# EAGLE design 0.2 (EAGLE 7.6.0)
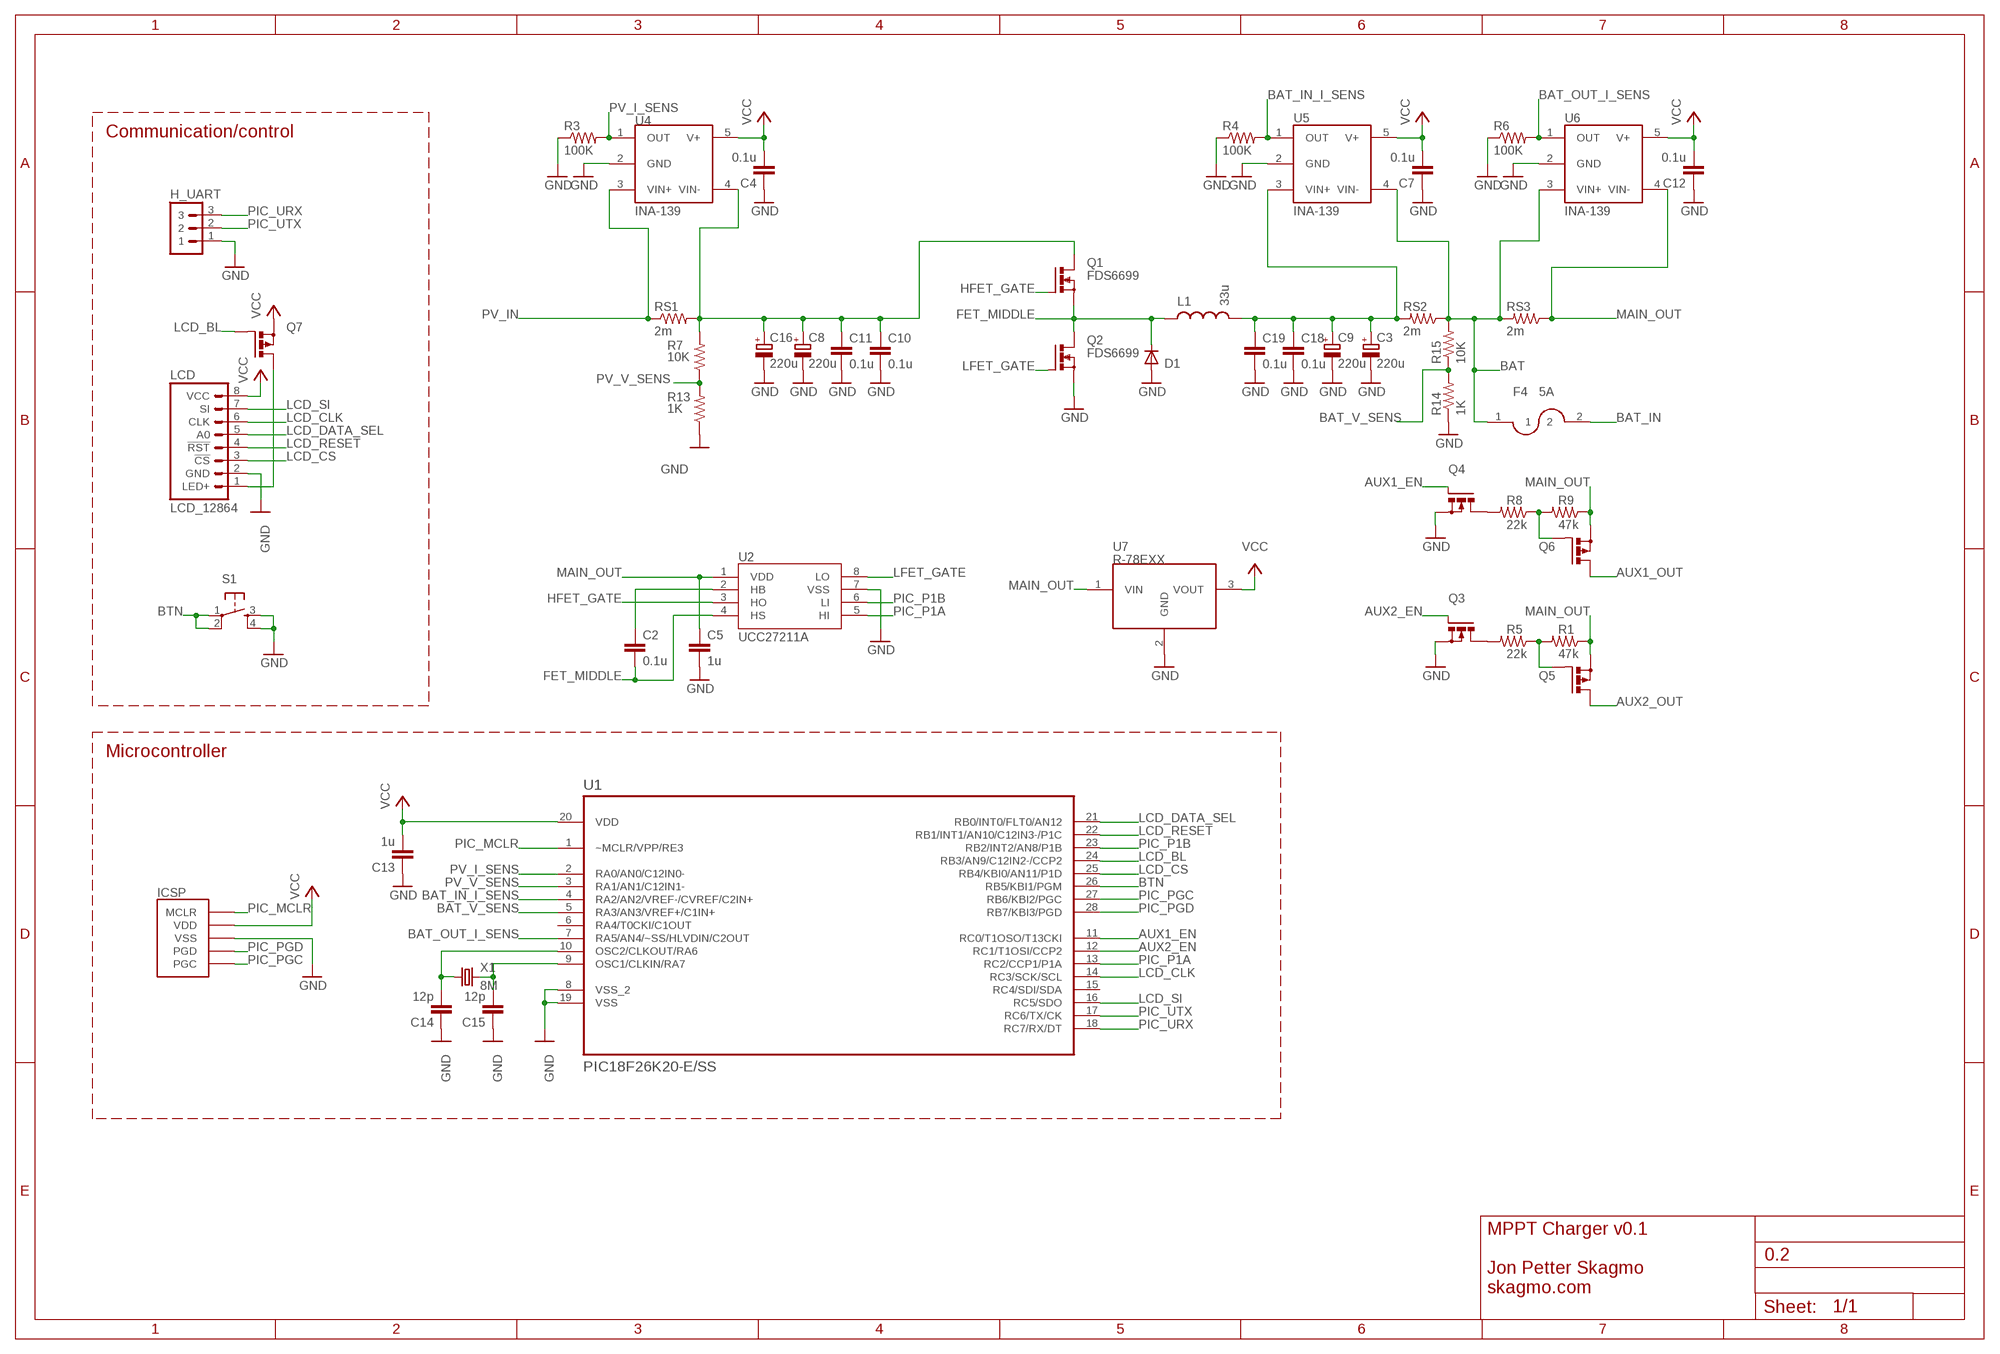
[diagram p0: schematic, sheet 1]

## Parts
C2  0.1u  CAP0603  [0603]
C3  220u  CPOL-EUE3.5-8  [E3,5-8]
C4  0.1u  CAP0603  [0603]
C5  1u  CAP0603  [0603]
C7  0.1u  CAP0603  [0603]
C8  220u  CPOL-EUE3.5-8  [E3,5-8]
C9  220u  CPOL-EUE3.5-8  [E3,5-8]
C10  0.1u  CAP0603  [0603]
C11  0.1u  CAP0603  [0603]
C12  0.1u  CAP0603  [0603]
C13  1u  CAP0603  [0603]
C14  12p  CAP0603  [0603]
C15  12p  CAP0603  [0603]
C16  220u  CPOL-EUE3.5-8  [E3,5-8]
C18  0.1u  CAP0603  [0603]
C19  0.1u  CAP0603  [0603]
D1  DIODESMB  [SMB-DIODE]
F4  5A  FUSE1206  [1206]
H_UART  H1X3_XH  [CON_B3B-XH-A]
ICSP  1X5_ICSP  [1X5_2MM]
L1  33u  INDUCTORIHLP-6767  [IHLP-6767]
LCD  LCD_12864  [LCD_12864]
Q1  FDS6699  PMOSFET_N  [SO08]
Q2  FDS6699  PMOSFET_N  [SO08]
Q3  MOSFET_N_SOT23-3  [SOT23-3]
Q4  MOSFET_N_SOT23-3  [SOT23-3]
Q5  PMOSFET_P  [SO08]
Q6  PMOSFET_P  [SO08]
Q7  MOSFET_P_SOT23  [SOT23-3]
R1  47k  RESISTOR0603  [0603]
R3  100K  RESISTOR0603  [0603]
R4  100K  RESISTOR0603  [0603]
R5  22k  RESISTOR0603  [0603]
R6  100K  RESISTOR0603  [0603]
R7  10K  RESISTOR0603  [0603]
R8  22k  RESISTOR0603  [0603]
R9  47k  RESISTOR0603  [0603]
R13  1K  RESISTOR0603  [0603]
R14  1K  RESISTOR0603  [0603]
R15  10K  RESISTOR0603  [0603]
RS1  2m  R-US_R3225  [R3225]
RS2  2m  R-US_R3225  [R3225]
RS3  2m  R-US_R3225  [R3225]
S1  TAC_SWITCH  [SWITCH_B3FS-1002P]
U1  PIC18F26K20-E/SS  [SOP65P780X200-28N]
U2  UCC27211A  [SO08]
U4  INA-139  INA-169  [SOT23-5]
U5  INA-139  INA-169  [SOT23-5]
U6  INA-139  INA-169  [SOT23-5]
U7  R-78EXX  [R-78EXX]
X1  8M  TXC-7A  [TXC-7A]

## Nets
AUX1_EN: Q4.1(G) U1.11(RC0/T1OSO/T13CKI)
AUX1_OUT: Q6.5(D) Q6.6(D) Q6.7(D) Q6.8(D)
AUX2_EN: Q3.1(G) U1.12(RC1/T1OSI/CCP2)
AUX2_OUT: Q5.5(D) Q5.6(D) Q5.7(D) Q5.8(D)
BAT: F4.1 R15.2 RS2.1 RS3.2 U5.4(VIN-) U6.3(VIN+)
BAT_IN: F4.2
BAT_IN_I_SENS: R4.2 U1.4(RA2/AN2/VREF-/CVREF/C2IN+) U5.1(OUT)
BAT_OUT_I_SENS: R6.2 U1.7(RA5/AN4/~SS/HLVDIN/C2OUT) U6.1(OUT)
BAT_V_SENS: R14.2 R15.1 U1.5(RA3/AN3/VREF+/C1IN+)
BTN: S1.1 S1.2 U1.26(RB5/KBI1/PGM)
FET_MIDDLE: C2.2 D1.C L1.P$1 Q1.1(S) Q1.2(S) Q1.3(S) Q2.5(D) Q2.6(D) Q2.7(D) Q2.8(D) U2.4(HS)
GND: C3.- C4.1 C5.2 C7.1 C8.- C9.- C10.2 C11.2 C12.1 C13.1 C14.1 C15.1 C16.- C18.2 C19.2 D1.A H_UART.1 ICSP.P$3(VSS) LCD.2(GND) Q2.1(S) Q2.2(S) Q2.3(S) Q3.2(S) Q4.2(S) R3.1 R4.1 R6.1 R13.1 R14.1 S1.3 S1.4 U1.8(VSS_2) U1.19(VSS) U2.7(VSS) U4.2(GND) U5.2(GND) U6.2(GND) U7.2(GND)
HFET_GATE: Q1.4(G) U2.3(HO)
LCD_BL: Q7.1(G) U1.24(RB3/AN9/C12IN2-/CCP2)
LCD_CLK: LCD.6(CLK) U1.14(RC3/SCK/SCL)
LCD_CS: LCD.3(!CS) U1.25(RB4/KBI0/AN11/P1D)
LCD_DATA_SEL: LCD.5(A0) U1.21(RB0/INT0/FLT0/AN12)
LCD_RESET: LCD.4(!RST) U1.22(RB1/INT1/AN10/C12IN3-/P1C)
LCD_SI: LCD.7(SI) U1.16(RC5/SDO)
LFET_GATE: Q2.4(G) U2.8(LO)
MAIN_OUT: C5.1 Q5.1(S) Q5.2(S) Q5.3(S) Q6.1(S) Q6.2(S) Q6.3(S) R1.1 R9.1 RS3.1 U2.1(VDD) U6.4(VIN-) U7.1(VIN)
N$2: C2.1 U2.2(HB)
N$3: Q3.3(D) R5.2
N$4: Q4.3(D) R8.2
N$5: C3.+ C9.+ C18.1 C19.1 L1.P$2 RS2.2 U5.3(VIN+)
N$7: Q5.4(G) R1.2 R5.1
N$14: C14.2 U1.10(OSC2/CLKOUT/RA6) X1.1
N$15: Q6.4(G) R8.1 R9.2
N$16: C15.2 U1.9(OSC1/CLKIN/RA7) X1.2
N$31: LCD.1(LED+) Q7.3(D)
PIC_MCLR: ICSP.P$1(MCLR) U1.1(~MCLR/VPP/RE3)
PIC_P1A: U1.13(RC2/CCP1/P1A) U2.5(HI)
PIC_P1B: U1.23(RB2/INT2/AN8/P1B) U2.6(LI)
PIC_PGC: ICSP.P$5(PGC) U1.27(RB6/KBI2/PGC)
PIC_PGD: ICSP.P$4(PGD) U1.28(RB7/KBI3/PGD)
PIC_URX: H_UART.3 U1.18(RC7/RX/DT)
PIC_UTX: H_UART.2 U1.17(RC6/TX/CK)
PV: C8.+ C10.1 C11.1 C16.+ Q1.5(D) Q1.6(D) Q1.7(D) Q1.8(D) R7.2 RS1.2 U4.4(VIN-)
PV_I_SENS: R3.2 U1.2(RA0/AN0/C12IN0-) U4.1(OUT)
PV_IN: RS1.1 U4.3(VIN+)
PV_V_SENS: R7.1 R13.2 U1.3(RA1/AN1/C12IN1-)
VCC: C4.2 C7.2 C12.2 C13.2 ICSP.P$2(VDD) LCD.8(VCC) Q7.2(S) U1.20(VDD) U4.5(V+) U5.5(V+) U6.5(V+) U7.3(VOUT)
Unconnected: U1.6(RA4/T0CKI/C1OUT) U1.15(RC4/SDI/SDA)

## Notes on the sheet
- Communication/control
- Microcontroller
- MPPT Charger v0.1
  
  Jon Petter Skagmo
  skagmo.com

## Library data of the parts
C2 C4 C5 C7 C10-C15 C18 C19 = 01-eos-components:CAP: Capacitor Standard 0603 ceramic capacitor, and 0.1" leaded capacitor.; PARTNO: *
C3 C8 C9 C16 = rcl:CPOL-EU: POLARIZED CAPACITOR, European symbol; PARTNO: 35ZLH220MEFC8X11.5
D1 = SparkFun:DIODE: Diode These are standard reverse protection diodes and small signal diodes. SMA package can handle up to about 1A. SOD-323 can handle about 200mA. What the SOD-323 package when ordering, there are some mfgs out there that are 5-pin packages.; PARTNO: SK54B-LTP
F4 = 01-eos-components:FUSE; PARTNO: C1T 5
H_UART = 01-eos-components:H1X3: Header 3 Standard 3-pin 0.1" header. Use with straight break away headers (SKU : PRT-00116), right angle break away headers (PRT-00553), swiss pins (PRT-00743), machine pins (PRT-00117), and female headers (PRT-00115). Molex polarized connector foot print use with SKU : PRT-08232 with associated crimp pins and housings.; PARTNO: B3B-XH-A (LF)(SN)(P)
ICSP = 01-eos-components:1X5_ICSP; PARTNO: *
L1 = 01-eos-components:INDUCTOR: Inductors Basic Inductor/Choke - 0603 and 1206. Footprints are not proven and vary greatly between part numbers.; PARTNO: IHLP6767GZER330M11
LCD = 01-eos-components:LCD_12864; PARTNO: *
Q1 Q2 = 01-eos-components:PMOSFET_N: Power MOSFET N-Channel; PARTNO: SI4128DY-T1-GE3
Q3 Q4 = 01-eos-components:MOSFET_N; PARTNO: BSH103,215
Q5 Q6 = 01-eos-components:PMOSFET_P: Power MOSFET P-Channel; PARTNO: FDS6681Z
Q7 = 01-eos-components:MOSFET_P; PARTNO: *
R1 R3-R9 R13-R15 = 01-eos-components:RESISTOR: Resistor Basic schematic elements and footprints for 0603, 1206, and PTH 1/10th watt (small) resistors.; PARTNO: *
RS1-RS3 = rcl:R-US_: RESISTOR, American symbol; PARTNO: PMR25HZPFV2L00
S1 = 00-mr-library:TAC_SWITCH: Momentary Switch Button commonly used for reset or general input. Spark Fun Electronics SKU : COM-00097; PARTNO: *
U1 = 01-eos-components:PIC18F26K20-E/SS: Flash Microcontrollers; MPN: PIC18F26K20-E/SS; OC_FARNELL: 1664860; OC_NEWARK: 88K6003; PACKAGE: SSOP-28; PARTNO: PIC18F26K22-I/SS; SUPPLIER: Microchip
U2 = 01-eos-components:UCC27211A; PARTNO: UCC27211D
U4-U6 = 08-maritime-components:INA-169; PARTNO: INA139NA/250
U7 = 03-vhf_sdr:R-78EXX; PARTNO: R-78E3.3-0.5
X1 = 00-mr-library:TXC-7A; PARTNO: 7A-8.000MAAE-T

## Board
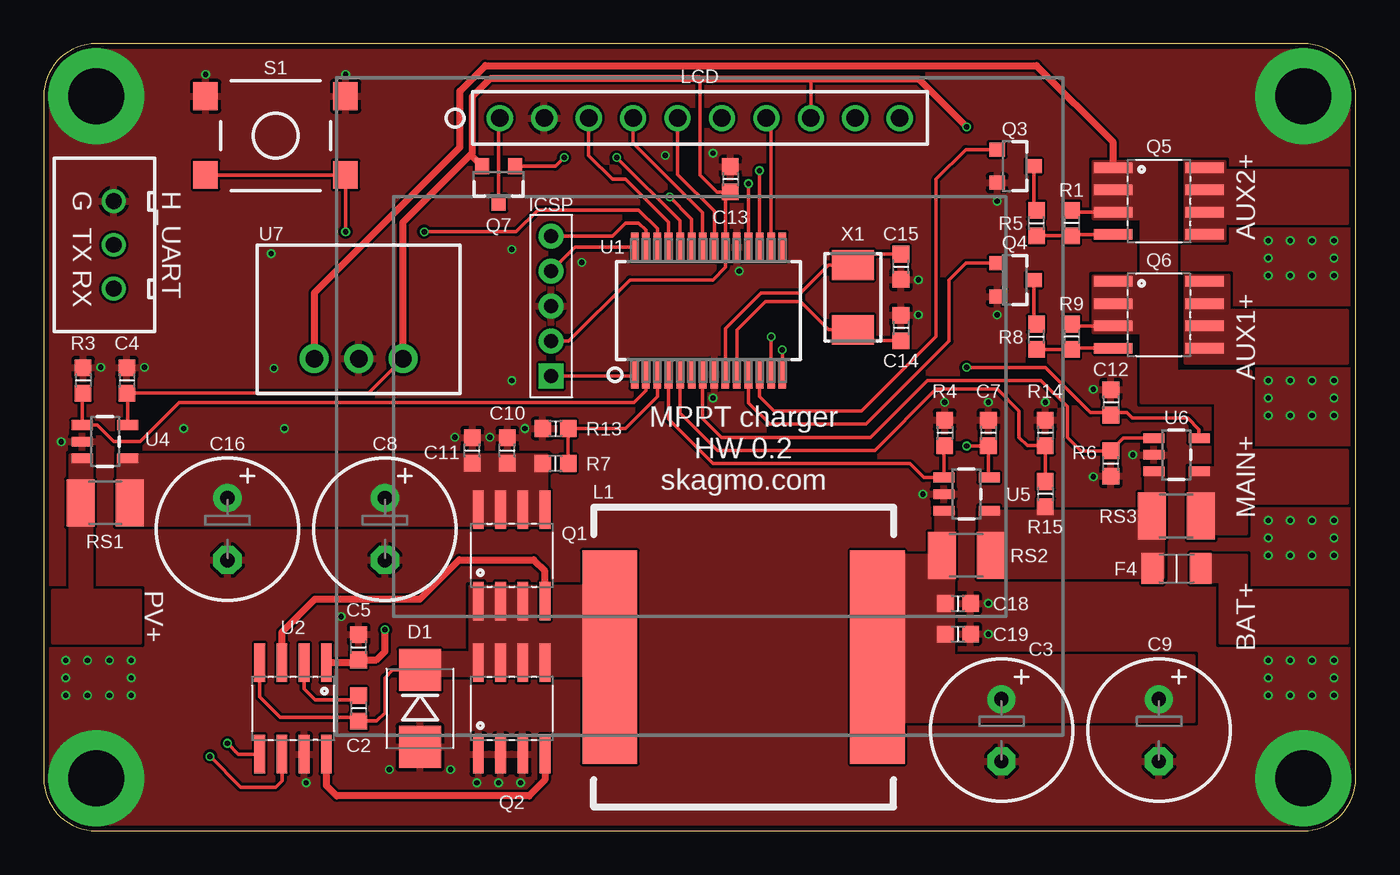
[diagram p1: board, top side]
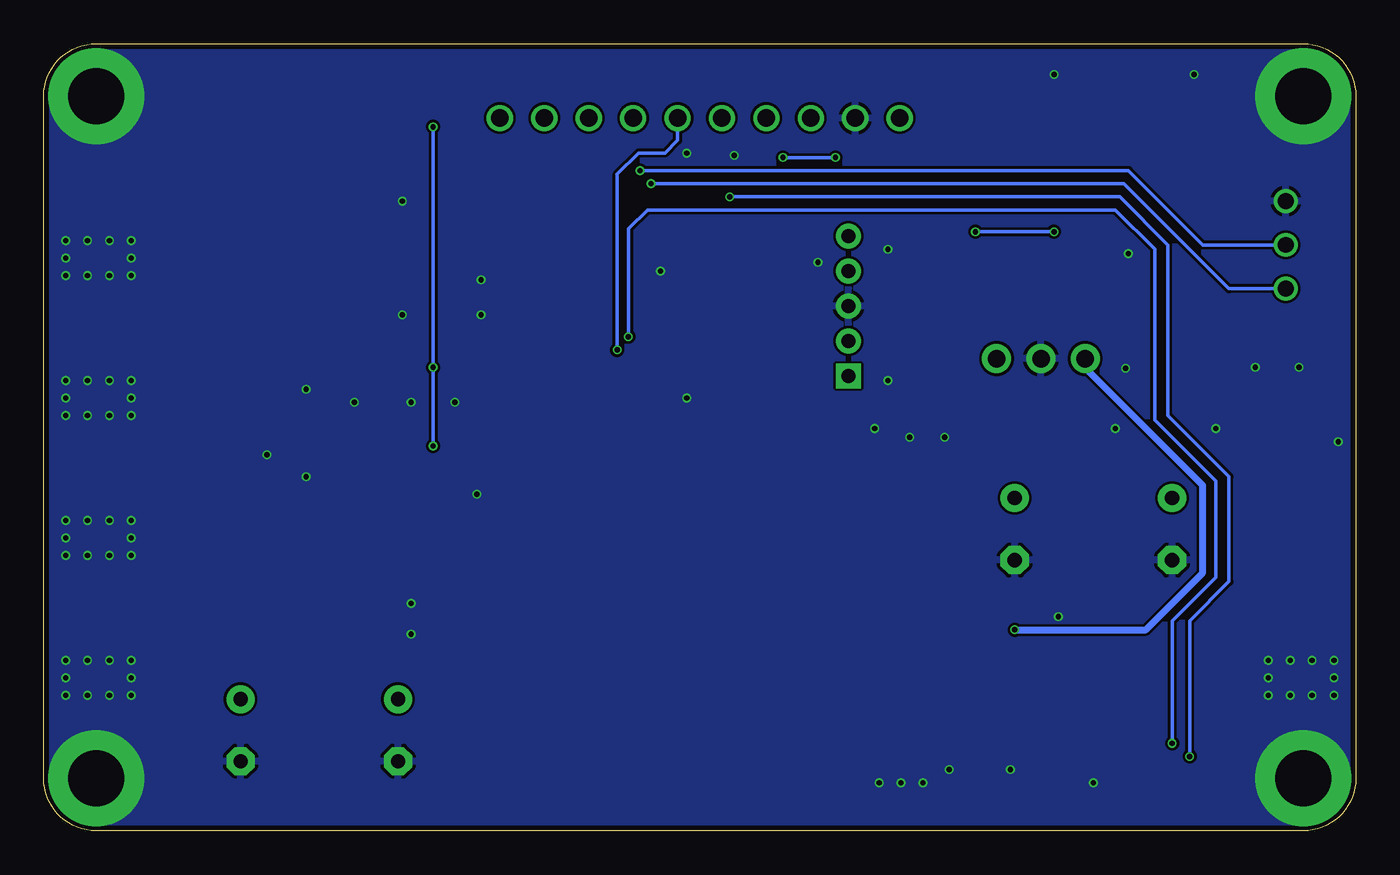
[diagram p2: board, bottom side, seen from below]

Size 75 x 45 mm. Coordinates in mm from the lower left corner, seen from the top.
Outline: 3,0 72,0 arc90 75,3 75,42 arc90 72,45 3,45 arc90 0,42 0,3 arc90 3,0
Copper layers (1+2*15+16): Top 0.035mm / dielectric 0.2mm / Route2 0.035mm / dielectric 1mm / Route15 0.035mm / dielectric 0.2mm / Bottom 0.035mm
Design rules "mr_drc": minimum track width 0.15mm, minimum drill 0.3mm, track to track 0.15mm, track to pad 0.15mm, pad to pad 0.15mm, via to via 0.15mm, smd to smd 0.05mm, copper to edge 0.3mm, drill to drill 0.5mm, minimum pad ring 0.1mm, minimum via ring 0.1mm, stop-mask expansion 0.05mm, vias tented up to drill 0.8mm, thermal gap 0.2mm

### Footprints (pad centres in the part's own frame; a part is rotated, then mirrored left to right if it is on the bottom)
0603 = smd 0.95 x 0.95: 1 -0.725,0; 2 0.725,0
E3,5-8 = drill 0.813 pad 1.6: + -1.778,0 | drill 0.813 pad 1.6 octagon: - 1.778,0
SMB-DIODE = smd 2.4 x 2.4: A 2.2,0; C -2.2,0
1206 = smd 1.25 x 1.75: 1 -1.375,0; 2 1.375,0
CON_B3B-XH-A = drill 0.9: 1 -2.5,0; 2 0,0; 3 2.5,0
1X5_2MM = drill 0.8 pad 1.422 square: P$1 -4,0 | drill 0.8 pad 1.422: P$2 -2,0; P$3 0,0; P$4 2,0; P$5 4,0
IHLP-6767 = smd 3.125 x 12.19: P$1 -7.647,0; P$2 7.647,0
LCD_12864 = drill 1: 1 -11.43,16.5; 2 -8.89,16.5; 3 -6.35,16.5; 4 -3.81,16.5; 5 -1.27,16.5; 6 1.27,16.5; 7 3.81,16.5; 8 6.35,16.5; 9 8.89,16.5; 10 11.43,16.5
SO08 = smd 0.61 x 2.21: 1 -1.905,-2.616; 2 -0.635,-2.616; 3 0.635,-2.616; 4 1.905,-2.616; 5 1.905,2.616; 6 0.635,2.616; 7 -0.635,2.616; 8 -1.905,2.616
SOT23-3 = smd 0.8 x 0.9: 1 -0.95,-1; 2 0.95,-1; 3 0,1.1
R3225 = smd 1.6 x 2.7: 1 -1.4,0; 2 1.4,0
SWITCH_B3FS-1002P = smd 1.4 x 1.6: 1 4,-2.25; 2 -4,-2.25; 3 4,2.25; 4 -4,2.25
SOP65P780X200-28N = smd 1.651 x 0.432: 1 -3.632,4.216; 2 -3.632,3.581; 3 -3.632,2.921; 4 -3.632,2.286; 5 -3.632,1.626; 6 -3.632,0.965; 7 -3.632,0.33; 8 -3.632,-0.33; 9 -3.632,-0.965; 10 -3.632,-1.626; 11 -3.632,-2.286; 12 -3.632,-2.921; 13 -3.632,-3.581; 14 -3.632,-4.216; 15 3.632,-4.216; 16 3.632,-3.581; 17 3.632,-2.921; 18 3.632,-2.286; 19 3.632,-1.626; 20 3.632,-0.965; 21 3.632,-0.33; 22 3.632,0.33; 23 3.632,0.965; 24 3.632,1.626; 25 3.632,2.286; 26 3.632,2.921; 27 3.632,3.581; 28 3.632,4.216
SOT23-5 = smd 0.55 x 1.2: 1 -0.95,-1.3; 2 0,-1.3; 3 0.95,-1.3; 4 0.95,1.3; 5 -0.95,1.3
R-78EXX = drill 1 pad 1.676: 1 -2.54,-2.25; 2 0,-2.25; 3 2.54,-2.25
TXC-7A = smd 1.7 x 2.4: 1 -1.85,0; 2 1.85,0

### Placement (x,y rotation side)
C2  18,7 270 top
C3  54.75,5.75 270 top
C4  4.75,25.75 270 top
C5  18,10.5 90 top
C7  54,22.75 270 top
C8  19.5,17.25 270 top
C9  63.75,5.75 270 top
C10  26.5,21.75 90 top
C11  24.5,21.75 90 top
C12  61,24.5 270 top
C13  39.25,37.25 270 top
C14  49,28.75 270 top
C15  49,32.25 90 top
C16  10.5,17.25 270 top
C18  52.25,13 0 top
C19  52.25,11.25 0 top
D1  21.5,7 270 top
F4  64.75,15 0 top
H_UART  4,33.5 270 top
ICSP  29,30 90 top
L1  40.01,9.93 0 top
LCD  37.5,24.25 0 top
Q1  26.75,15.75 0 top
Q2  26.75,7 0 top
Q3  55.5,38 270 top
Q4  55.5,31.5 270 top
Q5  63.75,36 270 top
Q6  63.75,29.5 270 top
Q7  26,37 180 top
R1  58.75,34.75 270 top
R3  2.25,25.75 270 top
R4  51.5,22.75 270 top
R5  56.75,34.75 90 top
R6  61,21 90 top
R7  29.25,21 180 top
R8  56.75,28.25 90 top
R9  58.75,28.25 270 top
R13  29.25,23 0 top
R14  57.25,22.75 270 top
R15  57.25,19.25 270 top
RS1  3.5,18.75 0 top
RS2  52.75,15.75 180 top
RS3  64.75,18 180 top
S1  13.25,39.75 0 top
U1  38,29.75 90 top
U2  14.25,7 180 top
U4  3.5,22.25 270 top
U5  52.75,19.25 270 top
U6  64.75,21.5 270 top
U7  18,29.25 0 top
X1  46.25,30.5 90 top

### Tracks (layer width: path | path; a pad name or v marks a point on that pad's centre or on a via)
AUX1_EN
  Top 0.2: U1.11 40.29,24.46 41.5,23.25 47,23.25 51.75,28 51.75,31.5 52.7,32.45 Q4.1
AUX1_OUT
  pour Top (no thermals): 74.5,26.75 65.25,26.75 65.25,31.75 67.75,31.75 67.75,29.75 74.5,29.75
AUX2_EN
  Top 0.2: U1.12 40.92,24.83 41.75,24 46.75,24 51,28.25 51,37.25 52.7,38.95 Q3.1
AUX2_OUT
  pour Top (no thermals): 74.5,34.75 67.5,34.75 67.5,33.75 65.25,33.75 65.25,38.25 67.5,38.25 67.5,37.75 74.5,37.75
BAT
  pour Top (no thermals): 53.5,14.5 64,14.5 64,20.75 63,20.75 63,18.25 53.5,18.25
BAT_IN
  pour Top (no thermals): 65.75,14.25 67.25,14.25 67.25,10.75 74.5,10.75 74.5,13.75 68.75,13.75 68.75,15.75 65.75,15.75
BAT_IN_I_SENS
  Top 0.2: U1.4 35.71,23.54 38.25,21 49.5,21 50.3,20.2 U5.1 51.45,21.98 R4.2 51.48,22
BAT_OUT_I_SENS
  Top 0.2: U1.7 37.67,23.58 38.75,22.5 47.25,22.5 50.5,25.75 57,25.75 58.5,24.25 58.5,22.5 59.27,21.73 R6.2 61.73,22.45 U6.1
BAT_V_SENS
  Top 0.2: R15.1 R14.2 56.23,22.02 55.75,22.5 55.75,24 54.5,25.25 51,25.25 47.5,21.75 38.5,21.75 36.37,23.88 U1.5
BTN  (via drill 0.3)
  Top 0.2: U1.26 35.08,34.42 34,35.5 28.25,35.5 27,34.25 v21.75,34.25 | v17.25,34.25 S1.1 S1.2
  Bottom 0.2: v21.75,34.25 v17.25,34.25
FET_MIDDLE
  Top 0.2: U2.4 12.35,7.66 13.5,6.5 17.77,6.5 C2.2 19.02,6.28 19.5,6.75 19.5,8.75 19.95,9.2 D1.C
  pour Top (no thermals): 20.7,8.89 33.02,8.89 33.02,13.97 24.38,13.97 24.38,10.16 20.7,10.16
GND  (via drill 0.3, 3.2 pad 5.5)
  other vias: 54,11.25 54,13 50,29.5 15,2.75 27.25,2.75 26,2.75 24.75,2.75 23.25,3.5 19.75,3.5 13.75,23 25.5,22.5 9.25,43.25 13.16,26.45 35.52,38.62 13,33 26.75,25.75 54.5,36 54.5,29.5 60,25.25 51.5,24.5 54,24.5 57.25,24.5 17,12.25 60,20.25 62.25,21.5 50.25,19.25 8,23 30.75,32.5 23.5,22.5 50,31.5 72,3 3,3 3,42 72,42 27.5,23 26.75,33.25 1,22.25 3.25,26.5 5.75,26.5 39.75,32 38.25,38.75 38.25,24.75 70,25.75 70,23.75 70,24.75 71.25,25.75 71.25,23.75 72.5,25.75 72.5,23.75 73.75,25.75 73.75,24.75 73.75,23.75 70,17.75 70,15.75 70,16.75 71.25,17.75 71.25,15.75 72.5,17.75 72.5,15.75 73.75,17.75 73.75,16.75 73.75,15.75 70,9.75 70,7.75 70,8.75 71.25,9.75 71.25,7.75 72.5,9.75 72.5,7.75 73.75,9.75 73.75,8.75 73.75,7.75 70,33.75 70,31.75 70,32.75 71.25,33.75 71.25,31.75 72.5,33.75 72.5,31.75 73.75,33.75 73.75,32.75 73.75,31.75 1.25,9.75 1.25,7.75 1.25,8.75 2.5,9.75 2.5,7.75 3.75,9.75 3.75,7.75 5,9.75 5,8.75 5,7.75 17.25,43.25
  pour Top (rank 2): -0.64,-0.64 75.56,-0.64 75.56,45.09 -0.64,45.09
  pour Bottom: -2,-2 77,-2 77,47 -2,47
HFET_GATE
  Top 0.4: U2.3 13.62,11.37 15.5,13.25 21.5,13.25 23.75,15.5 28,15.5 28.66,14.85 Q1.4
LCD_BL  (via drill 0.3)
  Top 0.2: U1.24 36.37,34.88 v32.75,38.5 | v29.75,38.5 29.25,38 Q7.1
  Bottom 0.2: v32.75,38.5 v29.75,38.5
LCD_CLK  (via drill 0.3)
  Top 0.2: U1.14 v42.22,27.5
  Bottom 0.2: LCD.6 38.77,39.48 39.5,38.75 41,38.75 42.22,37.53 v42.22,27.5
LCD_CS
  Top 0.2: U1.25 35.71,34.79 33.25,37.25 32.5,37.25 31.15,38.6 LCD.3
LCD_DATA_SEL
  Top 0.2: U1.21 38.33,35.42 36.23,37.52 LCD.5
LCD_RESET
  Top 0.2: U1.22 37.67,35.33 33.69,39.31 LCD.4
LCD_SI
  Top 0.2: U1.16 41.58,40.48 LCD.7
LFET_GATE
  Top 0.4: U2.8 16.16,2.6 16.75,2 27.75,2 28.66,2.9 Q2.4
MAIN_OUT  (via drill 0.3)
  Top 0.2: 17.84,9.62 C5.1 | Q6.3 58.86,28.86 R9.1 | Q5.3 58.86,35.37 R1.1
  Top 0.4: U2.1 17.84,9.62 | C5.1 19.02,9.78 19.5,10.25 v19.5,11.5 | Q5.1 61.13,39.37 56.75,43.75 25.25,43.75 23.79,42.29 23.79,39.08 15.46,30.75 U7.1
  Bottom 0.4: v19.5,11.5 12,11.5 8.75,14.75 8.75,19.75 15.46,26.46 U7.1
  pour Top (no thermals): 60.01,31.71 62.75,31.75 62.75,35 60,35 60,38.25 64.75,38.25 64.75,26.25 69,26.25 69,21.75 74.5,21.75 74.5,18.75 68.75,18.75 68.75,17 65.5,17 65.5,20.75 67,20.75 67,24.5 62.75,24.5 62.75,28.5 60,28.5
N$2
  Top 0.2: U2.2 14.88,8.12 15.5,7.5 17.77,7.5 C2.1
N$3
  Top 0.2: R5.2 56.6,35.62 Q3.3
N$4
  Top 0.2: Q4.3 56.6,29.12 R8.2
N$5
  Top 2.184: 47.49,6.53 47.62,6.67 47.62,11.4 L1.P$2
  pour Top (no thermals): 46.5,6.25 46.5,15.75 51,15.75 51,18.25 52,18.25 52,10 65.75,10 65.75,6.25
N$7
  Top 0.2: Q5.4 58.82,34.09 R1.2 R5.1
N$14
  Top 0.2: U1.10 39.63,28.63 41.25,30.25 43.25,30.25 44.85,28.65 X1.1 46.88,28.02 C14.2
N$15
  Top 0.2: Q6.4 58.82,27.59 R9.2 R8.1
N$16
  Top 0.2: U1.9 38.97,28.71 41,30.75 43.25,30.75 44.85,32.35 X1.2 46.88,32.98 C15.2
N$31
  Top 0.2: Q7.3 26,40.75 LCD.1
PIC_MCLR
  Top 0.2: ICSP.P$1 33.67,26 U1.1
PIC_P1A  (via drill 0.3)
  Top 0.2: U2.5 11.12,4.38 v10.5,5 | v41.58,28.25 U1.13
  Bottom 0.2: v10.5,5 10.5,12 8,14.5 8,20 11.5,23.5 11.5,33.25 13.75,35.5 40.5,35.5 41.58,34.42 v41.58,28.25
PIC_P1B  (via drill 0.3)
  Top 0.2: U2.6 13.62,2.87 13.25,2.5 11.25,2.5 v9.5,4.25 | v35.78,36.25 37,35 37.03,34.97 U1.23
  Bottom 0.2: v9.5,4.25 9.5,12 7.25,14.25 7.25,20.25 10.75,23.75 10.75,33.5 13.5,36.25 v35.78,36.25
PIC_PGC
  Top 0.2: U1.27 34.42,34.33 34,34.75 33.25,34.75 32.5,34 ICSP.P$5
PIC_PGD
  Top 0.2: ICSP.P$4 30.38,33.38 U1.28
PIC_URX  (via drill 0.3)
  Top 0.2: U1.18 v40.29,37
  Bottom 0.2: v40.29,37 13.25,37 7.25,31 H_UART.3
PIC_UTX  (via drill 0.3)
  Top 0.2: v40.92,37.75 U1.17
  Bottom 0.2: v40.92,37.75 13,37.75 8.75,33.5 H_UART.2
PV
  pour Top (no thermals): 28.75,17.5 4.25,17.5 4.25,21.5 28.75,21.5
PV_I_SENS
  Top 0.2: R3.2 2.2,24.98 U4.1 3.05,23.2 4,22.25 5.5,22.25 7.75,24.5 33.75,24.5 34.42,25.17 U1.2
PV_IN
  pour Top (no thermals): 2.75,21.5 1.5,21.5 1.5,13.75 0.5,13.75 0.5,10.75 5.5,10.75 5.5,13.75 2.75,13.75
PV_V_SENS
  Top 0.2: R7.1 R13.2 33.25,23 35.08,24.83 U1.3
VCC  (via drill 0.3)
  Top 0.2: 53.98,20.12 U5.5 54,20.25 C7.2 53.98,22 v52.75,22 | U6.5 66.04,22.32 66.04,22.95 65.41,23.59 62.23,23.59 61.91,23.91 60.73,23.91 | 60.73,23.91 C12.2 | U4.5 4.8,24.98 C4.2 18.57,25.02 U7.3 | 60.73,23.91 59.84,23.91 57.25,26.5 v52.75,26.5 | 37.5,43 37.5,37.5 38.48,36.52 C13.2 38.97,36.52 U1.20 38.97,32.22 38.25,31.5 33.5,31.5 30,28 ICSP.P$2 | LCD.8 43.85,43
  Top 0.4: v52.75,40.25 50,43 43.85,43 37.5,43 25.5,43 24.5,42 24.5,38.75 24.38,38.62 | 24.38,38.62 20.54,34.79 U7.3 | Q7.2 24.43,38.62 24.38,38.62
  Bottom 0.2: v52.75,22 v52.75,26.5 v52.75,40.25

### Text on the board
_tsilk: G | AUX2+ | TX | RX | AUX1+ | MPPT charger / HW 0.2 / skagmo.com | MAIN+ | PV+ | BAT+